# Altium schematic sheet EA08AI-V1.SchDoc
size 508 x 635 mm
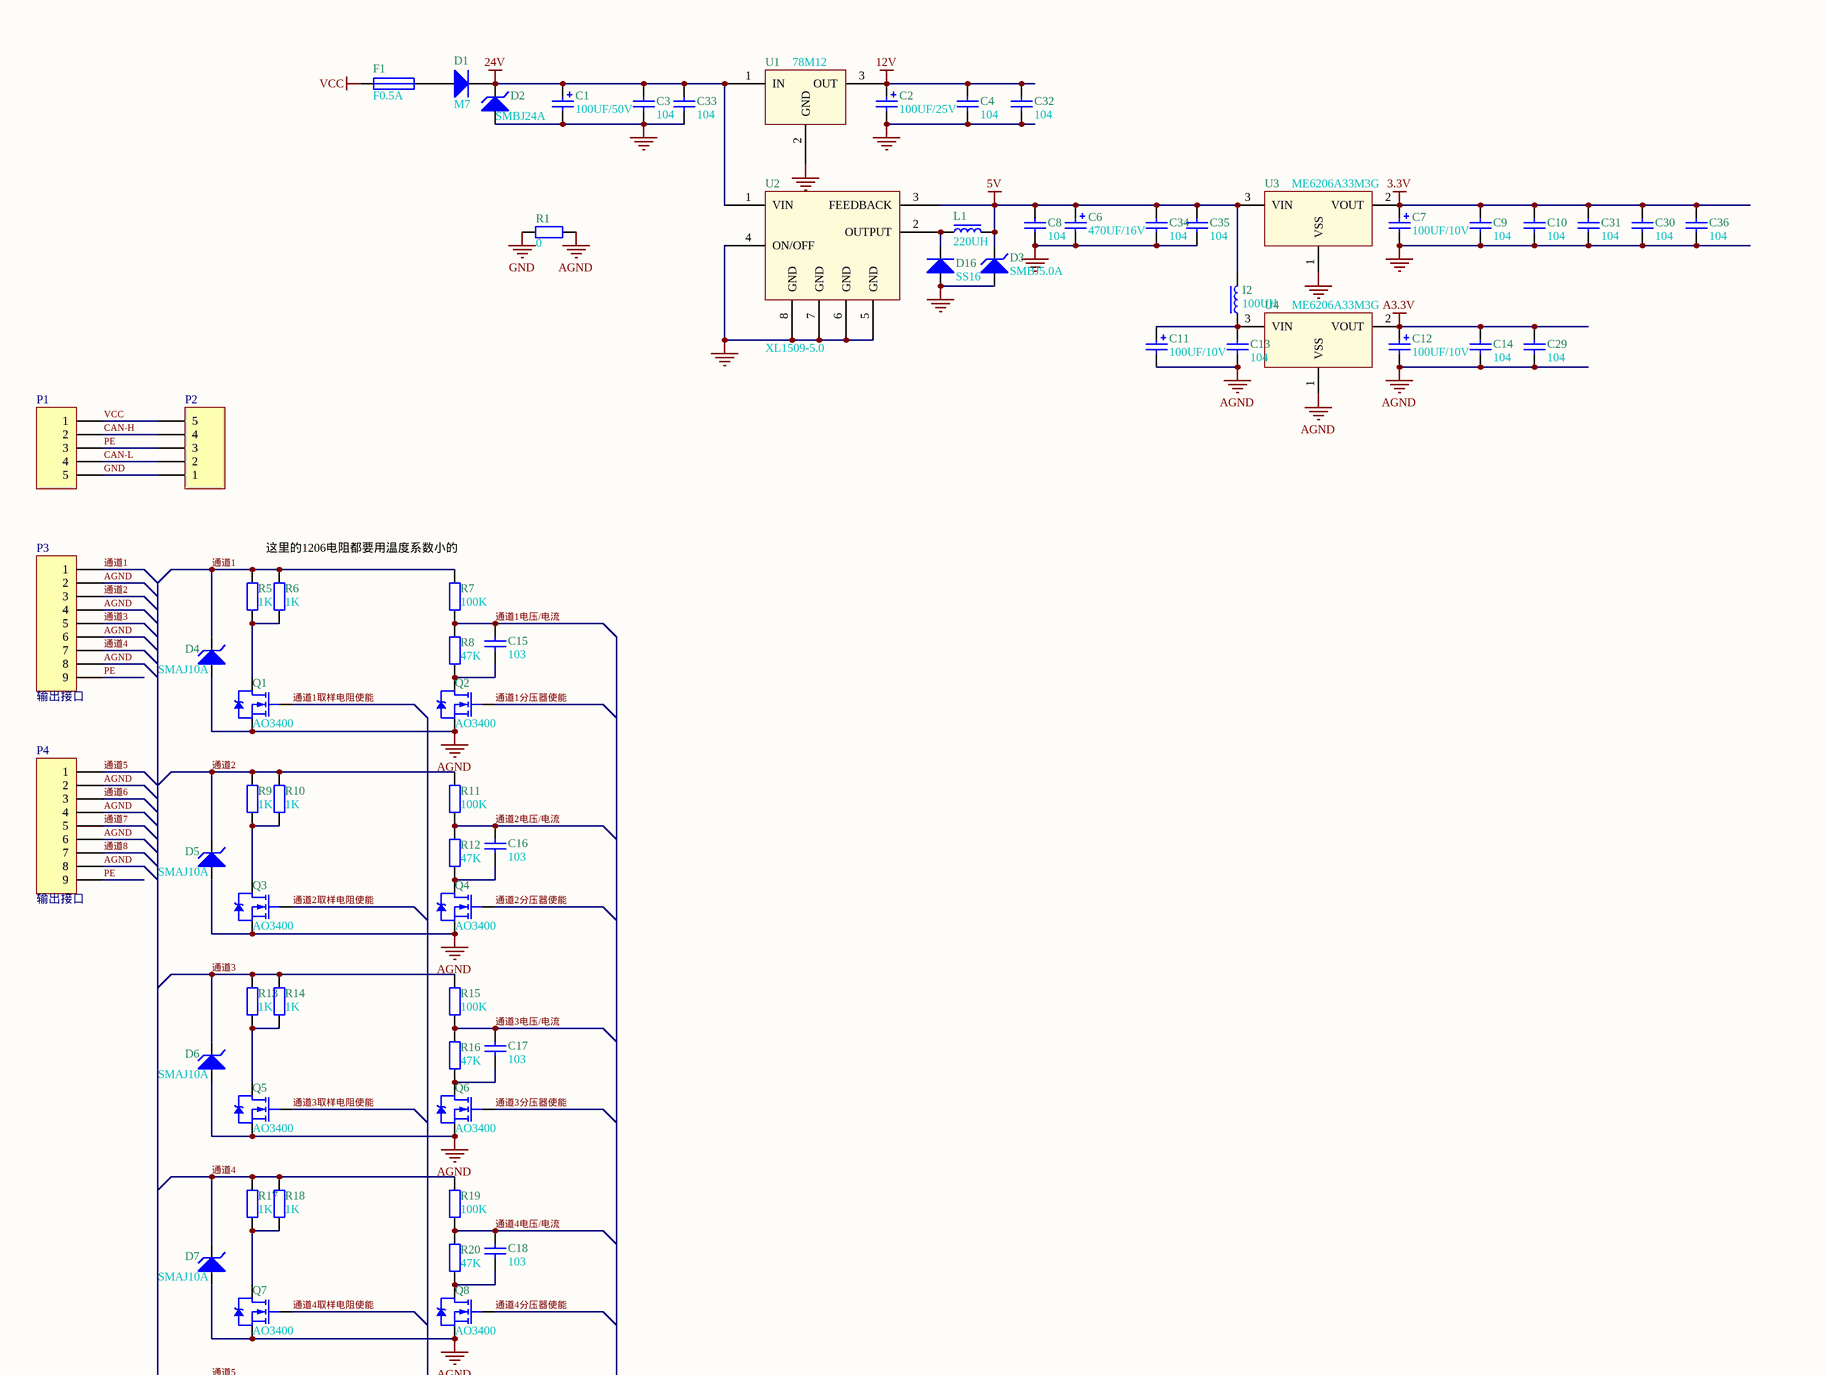
[diagram p0: EA08AI-V1.SchDoc, top]
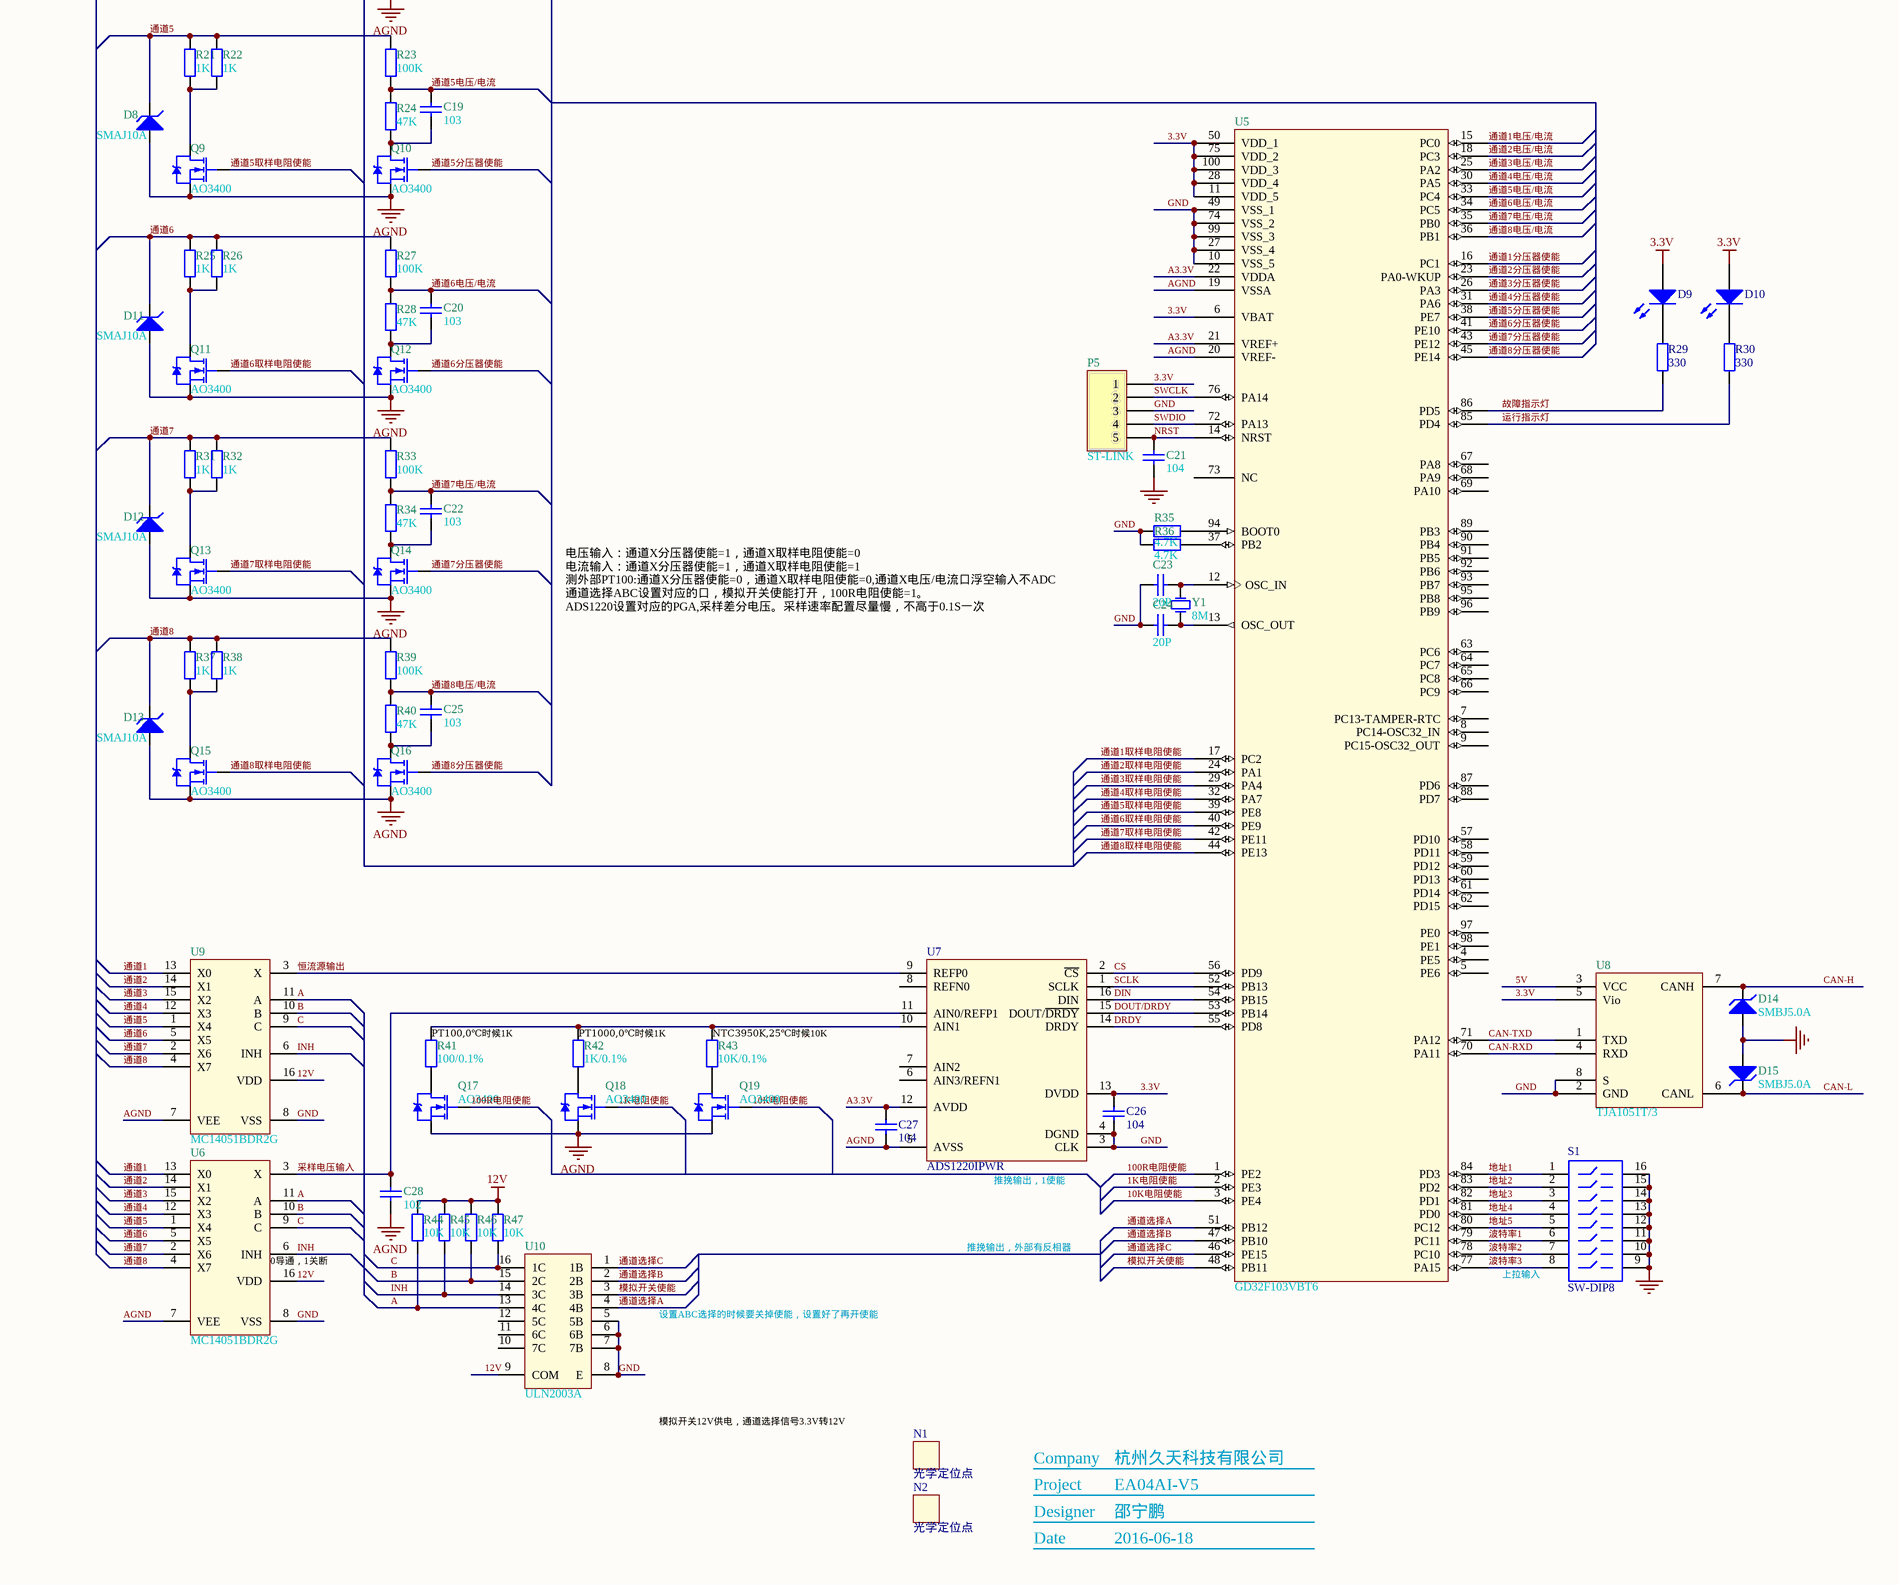
[diagram p1: EA08AI-V1.SchDoc, bottom]

## Parts
C1  100UF/50V  [贴片固态电容8*10-M]
C2  100UF/25V  [贴片固态电容5*5.3]
C3  104  [C-0603]
C4  104  [C-0603]
C6  470UF/16V  [贴片固态电容8*10-M]
C7  100UF/10V  [贴片固态电容5*5.3]
C8  104  [C-0603]
C9  104  [C-0603]
C10  104  [C-0603]
C11  100UF/10V  [贴片固态电容5*5.3]
C12  100UF/10V  [贴片固态电容5*5.3]
C13  104  [C-0603]
C14  104  [C-0603]
C15  103  [C-0603]
C16  103  [C-0603]
C17  103  [C-0603]
C18  103  [C-0603]
C19  103  [C-0603]
C20  103  [C-0603]
C21  104  [C-0603]
C22  103  [C-0603]
C23  20P  [C-0603]
C24  20P  [C-0603]
C25  103  [C-0603]
C26  104  [C-0603]
C27  104  [C-0603]
C28  102  [C-0603]
C29  104  [C-0603]
C30  104  [C-0603]
C31  104  [C-0603]
C32  104  [C-0603]
C33  104  [C-0603]
C34  104  [C-0603]
C35  104  [C-0603]
C36  104  [C-0603]
D1  M7  [SMA]
D2  SMBJ24A  [SMB]
D3  SMBJ5.0A  [SMB]
D4  SMAJ10A  [SMA]
D5  SMAJ10A  [SMA]
D6  SMAJ10A  [SMA]
D7  SMAJ10A  [SMA]
D8  SMAJ10A  [SMA]
D9  (no value)  [LED Φ3红2.54mm]
D10  (no value)  [LED Φ3绿2.54mm]
D11  SMAJ10A  [SMA]
D12  SMAJ10A  [SMA]
D13  SMAJ10A  [SMA]
D14  SMBJ5.0A  [SMB]
D15  SMBJ5.0A  [SMB]
D16  SS16  [SMA]
F1  F0.5A  [FUSE-1808]
I2  100UH  [CD54]
L1  220UH  [CD75]
N1  光学定位点  [MARK-1mm-3mm]
N2  光学定位点  [MARK-1mm-3mm]
P1  (no value)  [弯针5.08-M-5P]
P2  (no value)  [KF2EDGVC-5.08-5P弯针]
P3  输出接口  [KF2EDGVC-5.08-9P]
P4  输出接口  [KF2EDGVC-5.08-9P]
P5  ST-LINK  [5P下载口]
Q1  AO3400  [SOT-23]
Q2  AO3400  [SOT-23]
Q3  AO3400  [SOT-23]
Q4  AO3400  [SOT-23]
Q5  AO3400  [SOT-23]
Q6  AO3400  [SOT-23]
Q7  AO3400  [SOT-23]
Q8  AO3400  [SOT-23]
Q9  AO3400  [SOT-23]
Q10  AO3400  [SOT-23]
Q11  AO3400  [SOT-23]
Q12  AO3400  [SOT-23]
Q13  AO3400  [SOT-23]
Q14  AO3400  [SOT-23]
Q15  AO3400  [SOT-23]
Q16  AO3400  [SOT-23]
Q17  AO3400  [SOT-23]
Q18  AO3400  [SOT-23]
Q19  AO3400  [SOT-23]
R1  0  [R-1206]
R5  1K  [R-1206]
R6  1K  [R-1206]
R7  100K  [R-1206]
R8  47K  [R-1206]
R9  1K  [R-1206]
R10  1K  [R-1206]
R11  100K  [R-1206]
R12  47K  [R-1206]
R13  1K  [R-1206]
R14  1K  [R-1206]
R15  100K  [R-1206]
R16  47K  [R-1206]
R17  1K  [R-1206]
R18  1K  [R-1206]
R19  100K  [R-1206]
R20  47K  [R-1206]
R21  1K  [R-1206]
R22  1K  [R-1206]
R23  100K  [R-1206]
R24  47K  [R-1206]
R25  1K  [R-1206]
R26  1K  [R-1206]
R27  100K  [R-1206]
R28  47K  [R-1206]
R29  330  [R-0603]
R30  330  [R-0603]
R31  1K  [R-1206]
R32  1K  [R-1206]
R33  100K  [R-1206]
R34  47K  [R-1206]
R35  4.7K  [R-0603]
R36  4.7K  [R-0603]
R37  1K  [R-1206]
R38  1K  [R-1206]
R39  100K  [R-1206]
R40  47K  [R-1206]
R41  100/0.1%  [R-1206]
R42  1K/0.1%  [R-1206]
R43  10K/0.1%  [R-1206]
R44  10K  [R-0603]
R45  10K  [R-0603]
R46  10K  [R-0603]
R47  10K  [R-0603]
S1  SW-DIP8  [SW-蓝色拨码开关8P-加高]
U1  78M12  [TO-252]
U2  XL1509-5.0  [SOP-8-m]
U3  ME6206A33M3G  [SOT-23]
U4  ME6206A33M3G  [SOT-23]
U5  GD32F103VBT6  [LQFP100]
U6  MC14051BDR2G  [SOP-16-M]
U7  ADS1220IPWR  [TSSOP-16]
U8  TJA1051T/3  [SOP-8-m]
U9  MC14051BDR2G  [SOP-16-M]
U10  ULN2003A  [SOP-16-M]
Y1  8M  [HC-49SMD]

## Nets
3.3V: C7.1 C9.2 C10.2 C26.2 C30.2 C31.2 C36.2 D9.1(A) D10.1(A) P5.1 U3.2(VOUT) U5.6(VBAT) U5.11(VDD_5) U5.28(VDD_4) U5.50(VDD_1) U5.75(VDD_2) U5.100(VDD_3) U7.13(DVDD) U8.5(Vio)
5V: C6.1 C8.2 C34.2 C35.2 D3.2(K) I2.2 L1.2 U2.3(FEEDBACK) U3.3(VIN) U8.3(VCC)
12V: C2.1 C4.2 C32.2 R44.2 R45.2 R46.2 R47.2 U1.3(OUT) U6.16(VDD) U9.16(VDD) U10.9(COM)
24V: C1.1 C3.2 C33.2 D1.2(K) D2.2(K) U1.1(IN) U2.1(VIN)
A3.3V: C12.1 C14.2 C27.2 C29.2 U4.2(VOUT) U5.21(VREF+) U5.22(VDDA) U7.12(AVDD)
AGND: C11.2 C12.2 C13.1 C14.1 C27.1 C28.1 C29.1 D4.1(A) D5.1(A) D6.1(A) D7.1(A) D8.1(A) D11.1(A) D12.1(A) D13.1(A) P3.2 P3.4 P3.6 P3.8 P4.2 P4.4 P4.6 P4.8 Q1.2(S) Q2.2(S) Q3.2(S) Q4.2(S) Q5.2(S) Q6.2(S) Q7.2(S) Q8.2(S) Q9.2(S) Q10.2(S) Q11.2(S) Q12.2(S) Q13.2(S) Q14.2(S) Q15.2(S) Q16.2(S) Q17.2(S) Q18.2(S) Q19.2(S) R1.2 U4.1(VSS) U5.19(VSSA) U5.20(VREF-) U6.7(VEE) U7.5(AVSS) U9.7(VEE)
GND: C1.2 C2.2 C3.1 C4.1 C6.2 C7.2 C8.1 C9.1 C10.1 C21.1 C23.1 C24.1 C26.1 C30.1 C31.1 C32.1 C33.1 C34.1 C35.1 C36.1 D2.1(A) D3.1(A) D14.1(A) D15.1(A) D16.1(A) P1.5 P2.1 P5.3 R1.1 R35.2 R36.2 S1.9 S1.10 S1.11 S1.12 S1.13 S1.14 S1.15 S1.16 U1.2(GND) U2.4(ON/OFF) U2.5(GND) U2.6(GND) U2.7(GND) U2.8(GND) U3.1(VSS) U5.10(VSS_5) U5.27(VSS_4) U5.49(VSS_1) U5.74(VSS_2) U5.99(VSS_3) U6.8(VSS) U7.3(CLK) U7.4(DGND) U8.2(GND) U8.8(S) U9.8(VSS) U10.5(5B) U10.6(6B) U10.7(7B) U10.8(E)
VCC: F1.1 P1.1 P2.5
1K电阻使能: Q18.1(G) U5.2(PE3)
10K电阻使能: Q19.1(G) U5.3(PE4)
100R电阻使能: Q17.1(G) U5.1(PE2)
A: R44.1 U6.11(A) U9.11(A) U10.13(4C)
B: R46.1 U6.10(B) U9.10(B) U10.15(2C)
C: R47.1 U6.9(C) U9.9(C) U10.16(1C)
CAN-H: D14.2(K) P1.2 P2.4 U8.7(CANH)
CAN-L: D15.2(K) P1.4 P2.2 U8.6(CANL)
CAN-RXD: U5.70(PA11) U8.4(RXD)
CAN-TXD: U5.71(PA12) U8.1(TXD)
CS: U5.56(PD9) U7.2(~{CS})
DIN: U5.54(PB15) U7.16(DIN)
DOUT/DRDY: U5.53(PB14) U7.15(DOUT/~{DRDY})
DRDY: U5.55(PD8) U7.14(DRDY)
INH: R45.1 U6.6(INH) U9.6(INH) U10.14(3C)
NRST: C21.2 P5.5 U5.14(NRST)
PE: P1.3 P2.3 P3.9 P4.9
SCLK: U5.52(PB13) U7.1(SCLK)
SWCLK: P5.2 U5.76(PA14)
SWDIO: P5.4 U5.72(PA13)
地址1: S1.1 U5.84(PD3)
地址2: S1.2 U5.83(PD2)
地址3: S1.3 U5.82(PD1)
地址4: S1.4 U5.81(PD0)
地址5: S1.5 U5.80(PC12)
恒流源输出: U7.9(REFP0) U9.3(X)
故障指示灯: R29.1 U5.86(PD5)
模拟开关使能: U5.48(PB11) U10.3(3B)
波特率1: S1.6 U5.79(PC11)
波特率2: S1.7 U5.78(PC10)
波特率3: S1.8 U5.77(PA15)
运行指示灯: R30.1 U5.85(PD4)
通道1: D4.2(K) P3.1 R5.2 R6.2 R7.2 U6.13(X0) U9.13(X0)
通道1分压器使能: Q2.1(G) U5.16(PC1)
通道1取样电阻使能: Q1.1(G) U5.17(PC2)
通道1电压/电流: C15.2 R7.1 R8.2 U5.15(PC0)
通道2: D5.2(K) P3.3 R9.2 R10.2 R11.2 U6.14(X1) U9.14(X1)
通道2分压器使能: Q4.1(G) U5.23(PA0-WKUP)
通道2取样电阻使能: Q3.1(G) U5.24(PA1)
通道2电压/电流: C16.2 R11.1 R12.2 U5.18(PC3)
通道3: D6.2(K) P3.5 R13.2 R14.2 R15.2 U6.15(X2) U9.15(X2)
通道3分压器使能: Q6.1(G) U5.26(PA3)
通道3取样电阻使能: Q5.1(G) U5.29(PA4)
通道3电压/电流: C17.2 R15.1 R16.2 U5.25(PA2)
通道4: D7.2(K) P3.7 R17.2 R18.2 R19.2 U6.12(X3) U9.12(X3)
通道4分压器使能: Q8.1(G) U5.31(PA6)
通道4取样电阻使能: Q7.1(G) U5.32(PA7)
通道4电压/电流: C18.2 R19.1 R20.2 U5.30(PA5)
通道5: D8.2(K) P4.1 R21.2 R22.2 R23.2 U6.1(X4) U9.1(X4)
通道5分压器使能: Q10.1(G) U5.38(PE7)
通道5取样电阻使能: Q9.1(G) U5.39(PE8)
通道5电压/电流: C19.2 R23.1 R24.2 U5.33(PC4)
通道6: D11.2(K) P4.3 R25.2 R26.2 R27.2 U6.5(X5) U9.5(X5)
通道6分压器使能: Q12.1(G) U5.41(PE10)
通道6取样电阻使能: Q11.1(G) U5.40(PE9)
通道6电压/电流: C20.2 R27.1 R28.2 U5.34(PC5)
通道7: D12.2(K) P4.5 R31.2 R32.2 R33.2 U6.2(X6) U9.2(X6)
通道7分压器使能: Q14.1(G) U5.43(PE12)
通道7取样电阻使能: Q13.1(G) U5.42(PE11)
通道7电压/电流: C22.2 R33.1 R34.2 U5.35(PB0)
通道8: D13.2(K) P4.7 R37.2 R38.2 R39.2 U6.4(X7) U9.4(X7)
通道8分压器使能: Q16.1(G) U5.45(PE14)
通道8取样电阻使能: Q15.1(G) U5.44(PE13)
通道8电压/电流: C25.2 R39.1 R40.2 U5.36(PB1)
通道选择A: U5.51(PB12) U10.4(4B)
通道选择B: U5.47(PB10) U10.2(2B)
通道选择C: U5.46(PE15) U10.1(1B)
采样电压输入: C28.2 U6.3(X) U7.11(AIN0/REFP1)
NetC11_1: C11.1 C13.2 I2.1 U4.3(VIN)
NetC15_1: C15.1 Q2.3(D) R8.1
NetC16_1: C16.1 Q4.3(D) R12.1
NetC17_1: C17.1 Q6.3(D) R16.1
NetC18_1: C18.1 Q8.3(D) R20.1
NetC19_1: C19.1 Q10.3(D) R24.1
NetC20_1: C20.1 Q12.3(D) R28.1
NetC22_1: C22.1 Q14.3(D) R34.1
NetC23_2: C23.2 U5.12(OSC_IN) Y1.2(OSC2)
NetC24_2: C24.2 U5.13(OSC_OUT) Y1.1(OSC1)
NetC25_1: C25.1 Q16.3(D) R40.1
NetD1_1: D1.1(A) F1.2
NetD9_2: D9.2(K) R29.2
NetD10_2: D10.2(K) R30.2
NetD16_2: D16.2(K) L1.1 U2.2(OUTPUT)
NetQ1_3: Q1.3(D) R5.1 R6.1
NetQ3_3: Q3.3(D) R9.1 R10.1
NetQ5_3: Q5.3(D) R13.1 R14.1
NetQ7_3: Q7.3(D) R17.1 R18.1
NetQ9_3: Q9.3(D) R21.1 R22.1
NetQ11_3: Q11.3(D) R25.1 R26.1
NetQ13_3: Q13.3(D) R31.1 R32.1
NetQ15_3: Q15.3(D) R37.1 R38.1
NetQ17_3: Q17.3(D) R41.1
NetQ18_3: Q18.3(D) R42.1
NetQ19_3: Q19.3(D) R43.1
NetR35_1: R35.1 U5.94(BOOT0)
NetR36_1: R36.1 U5.37(PB2)
NetR41_2: R41.2 R42.2 R43.2 U7.10(AIN1)

Not connected (* = marked no-connect by the designer): U5 4(PE5) 5(PE6) 7(PC13-TAMPER-RTC) 8(PC14-OSC32_IN) 9(PC15-OSC32_OUT) 57(PD10) 58(PD11) 59(PD12) 60(PD13) 61(PD14) 62(PD15) 63(PC6) 64(PC7) 65(PC8) 66(PC9) 67(PA8) 68(PA9) 69(PA10) 73(NC) 87(PD6) 88(PD7) 89(PB3) 90(PB4) 91(PB5) 92(PB6) 93(PB7) 95(PB8) 96(PB9) 97(PE0) 98(PE1); U7 6(AIN3/REFN1) 7(AIN2) 8(REFN0); U10 10(7C) 11(6C) 12(5C)

## Notes on the sheet
- 这里的1206电阻都要用温度系数小的
- 电压输入：通道X分压器使能=1，通道X取样电阻使能=0
  电流输入：通道X分压器使能=1，通道X取样电阻使能=1
  测外部PT100:通道X分压器使能=0，通道X取样电阻使能=0,通道X电压/电流口浮空输入不ADC
  通道选择ABC设置对应的口，模拟开关使能打开，100R电阻使能=1。
  ADS1220设置对应的PGA,采样差分电压。采样速率配置尽量慢，不高于0.1S一次
- (near R41) PT100,0℃时候1K
- (near R42) PT1000,0℃时候1K
- (near R43) NTC3950K,25℃时候10K
- (near U7) 推挽输出，1使能
- (near U6) 0导通，1关断
- 推挽输出，外部有反相器
- 设置ABC选择的时候要关掉使能，设置好了再开使能
- 上拉输入
- (near U10) 模拟开关12V供电，通道选择信号3.3V转12V
- Company
- 杭州久天科技有限公司
- Project
- Designer
- EA04AI-V5
- 邵宁鹏
- Date
- 2016-06-18

## Library data of the parts
C1 C2 C6 C7 C11 C12 = Cap Pol1: Polarized Capacitor (Radial); Published: 8-Jun-2000; LatestRevisionDate: 17-Jul-2002; LatestRevisionNote: Re-released for DXP Platform.; PackageReference: RB7.6-15; Publisher: Altium Limited
C3 C4 C8-C10 C13 C14 C21 C28-C36 = Cap: Capacitor; Published: 8-Jun-2000; LatestRevisionDate: 17-Jul-2002; LatestRevisionNote: Re-released for DXP Platform.; PackageReference: RAD-0.3; Publisher: Altium Limited
C15-C20 C22-C27 = Cap-0603: 0805; Published: 8-Jun-2000; LatestRevisionDate: 17-Jul-2002; LatestRevisionNote: Re-released for DXP Platform.; PackageReference: RAD-0.3; Publisher: Altium Limited
D1 = M7: SMA; Published: 8-Jun-2000; LatestRevisionDate: 17-Jul-2002; LatestRevisionNote: Re-released for DXP Platform.; DatasheetVersion: 1989; PackageVersion: 1989; PackageReference: DO-35A; Publisher: Altium Limited; Code_JEDEC: DO-204-AH; ComponentLink1Description: Manufacturer Link; ComponentLink1URL: http://www.national.com/
D2-D8 D11-D15 = TVS-1: SMB
D9 D10 = LED-0603-Blue: Published: 8-Jun-2000; LatestRevisionDate: 08-Jul-2005; LatestRevisionNote: Mech Layer 1 removed.; PackageReference: LED-0; Publisher: Altium Limited
D16 = SS14: SMA
F1 = Fuse 1: Fuse; Published: 8-Jun-2000; LatestRevisionDate: 17-Jul-2002; LatestRevisionNote: Re-released for DXP Platform.; PackageReference: PIN-W2/E2.8; Publisher: Altium Limited
I2 L1 = Inductance3
N1 N2 = 无引脚
P1 P2 P5 = Header 5: Header, 5-Pin; LatestRevisionDate: 17-Jul-2002; LatestRevisionNote: Re-released for DXP Platform.; Publisher: Altium Limited
P3 P4 = Header 9: Header, 9-Pin; LatestRevisionDate: 17-Jul-2002; LatestRevisionNote: Re-released for DXP Platform.; Publisher: Altium Limited
Q1-Q19 = AO3400: SOT-23
R1 R5-R47 = Res2-0603: 0603; Published: 8-Jun-2000; LatestRevisionDate: 17-Jul-2002; LatestRevisionNote: Re-released for DXP Platform.; PackageReference: AXIAL-0.4; Publisher: Altium Limited
U1 = 78M05: TO-252
U2 = XL1509-ADJ: 开关电源 SOP-8
U3 U4 = ME6206A33M3G: LDO稳压 SOT-23
U5 = GD32F103V
U7 = ADS1220IPWR: 24位四通道ADC
Y1 = 晶振
S1 = SW-DIP8: Published: 24-Mar-1999; LatestRevisionDate: 17-Dec-2003; LatestRevisionNote: PCB Footprint replaced.; PackageReference: DIP-16-KEY; Publisher: Altium Limited; ComponentLink1Description: Manufacturer Link; ComponentLink1URL: http://www.oupiin.com/prodindx.html#Headers